# Altium schematic sheet secondary_LTC.SchDoc: foxBMS BMS-Slave 12-Cell
size A3; DocumentNumber: 21; SheetNumber: 21; SheetTotal: 21; AUTHOR: Fraunhofer IISB foxBMS Team; SheetDescription: Secondary LTC6811
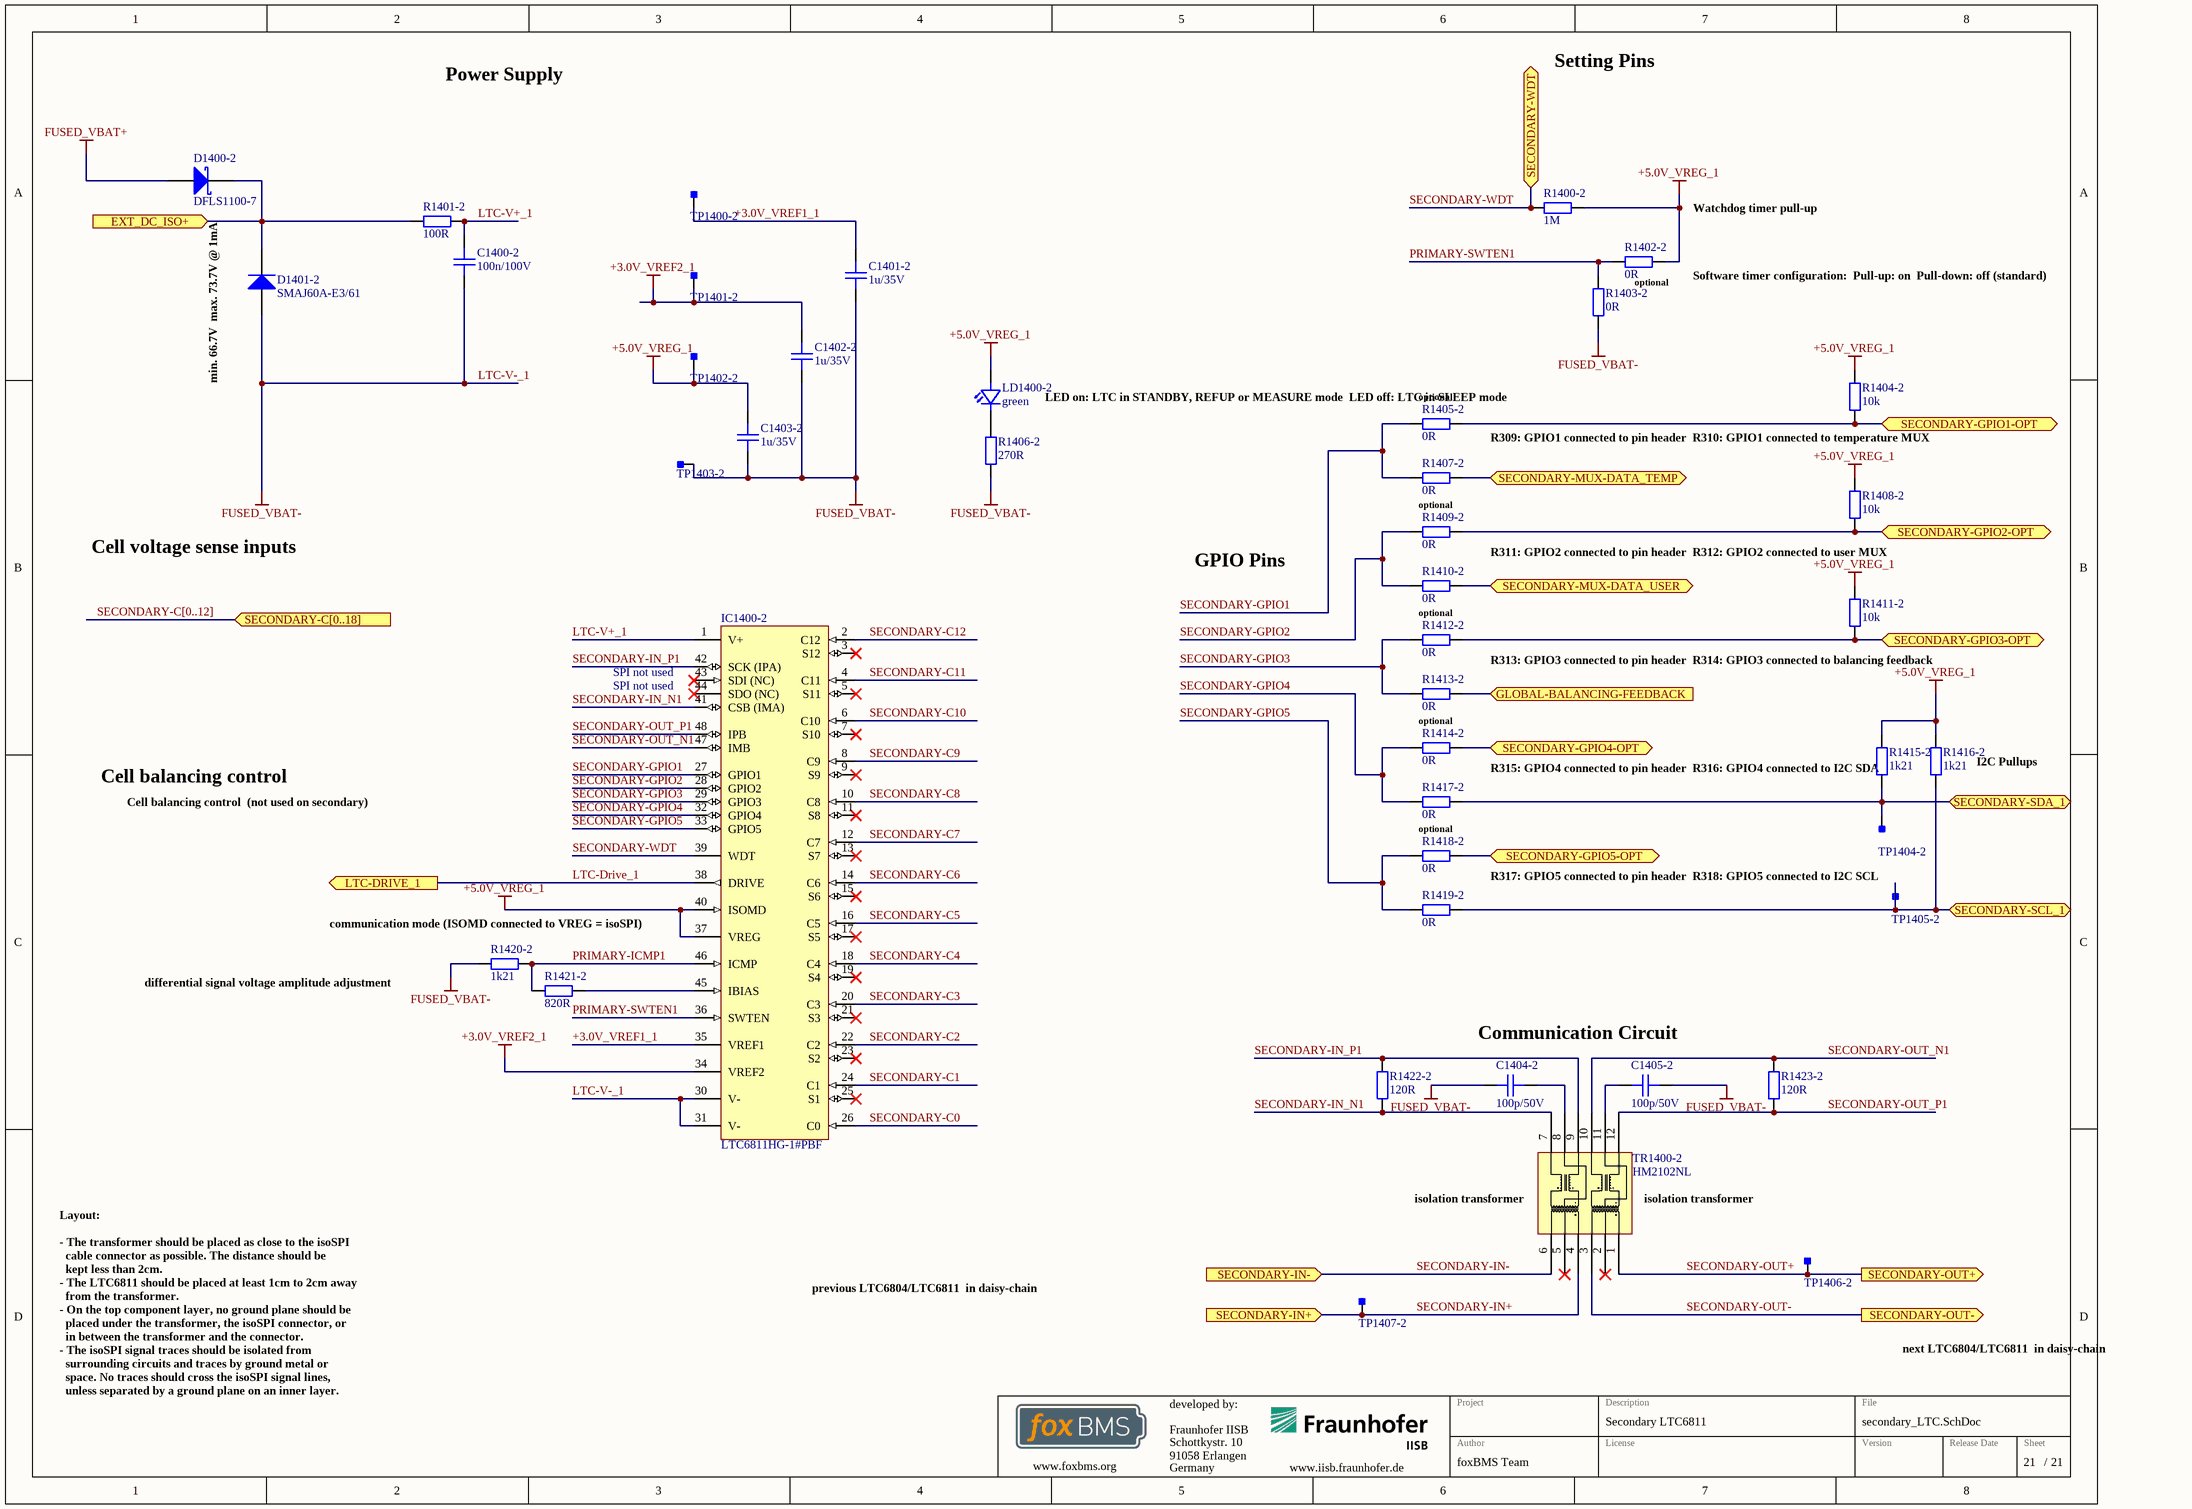
[diagram p0: secondary_LTC.SchDoc]

## Parts
C1400-2  100n/100V  [CAPC2012X14N]
C1401-2  1u/35V  [CAPC1608X08N]
C1402-2  1u/35V  [CAPC1608X08N]
C1403-2  1u/35V  [CAPC1608X08N]
C1404-2  100p/50V  [CAPC1608X08N]
C1405-2  100p/50V  [CAPC1608X08N]
D1400-2  DFLS1100-7  [DIOD-POWERDI123-2_V]
D1401-2  SMAJ60A-E3/61  [VISH-DO-214AC-2_N]
IC1400-2  LTC6811HG-1#PBF  [LT-G-48_L]
LD1400-2  green  [LEDC1608X07N]
R1400-2  1M  [RESC1608X05N]
R1401-2  100R  [RESC2012X05N]
R1402-2  0R  [RESC1608X05N]
R1403-2  0R  [RESC1608X05N]
R1404-2  10k  [RESC1608X05N]
R1405-2  0R  [RESC1608X05N]
R1406-2  270R  [RESC1608X05N]
R1407-2  0R  [RESC1608X05N]
R1408-2  10k  [RESC1608X05N]
R1409-2  0R  [RESC1608X05N]
R1410-2  0R  [RESC1608X05N]
R1411-2  10k  [RESC1608X05N]
R1412-2  0R  [RESC1608X05N]
R1413-2  0R  [RESC1608X05N]
R1414-2  0R  [RESC1608X05N]
R1415-2  1k21  [RESC1608X05N]
R1416-2  1k21  [RESC1608X05N]
R1417-2  0R  [RESC1608X05N]
R1418-2  0R  [RESC1608X05N]
R1419-2  0R  [RESC1608X05N]
R1420-2  1k21  [RESC1608X05N]
R1421-2  820R  [RESC1608X05N]
R1422-2  120R  [RESC1608X05N]
R1423-2  120R  [RESC1608X05N]
TP1400-2  Testpoint_Square  [Testpoint_S1]  (value not drawn)  (no BOM)
TP1401-2  Testpoint_Square  [Testpoint_S1]  (value not drawn)  (no BOM)
TP1402-2  Testpoint_Square  [Testpoint_S1]  (value not drawn)  (no BOM)
TP1403-2  Testpoint_Square  [Testpoint_S1]  (value not drawn)  (no BOM)
TP1404-2  Testpoint_Square  [Testpoint_S1]  (value not drawn)  (no BOM)
TP1405-2  Testpoint_Square  [Testpoint_S1]  (value not drawn)  (no BOM)
TP1406-2  Testpoint_Square  [Testpoint_S1]  (value not drawn)  (no BOM)
TP1407-2  Testpoint_Square  [Testpoint_S1]  (value not drawn)  (no BOM)
TR1400-2  HM2102NL  [HM2102NL]

## Ports
EXT_DC_ISO+ (in), GLOBAL-BALANCING-FEEDBACK (in), LTC-DRIVE_1 (out), SECONDARY-C[0..18] (in), SECONDARY-GPIO1-OPT (bidir), SECONDARY-GPIO2-OPT (bidir), SECONDARY-GPIO3-OPT (bidir), SECONDARY-GPIO4-OPT (bidir), SECONDARY-GPIO5-OPT (bidir), SECONDARY-IN+ (in), SECONDARY-IN- (in), SECONDARY-MUX-DATA_TEMP (bidir), SECONDARY-MUX-DATA_USER (bidir), SECONDARY-OUT+ (out), SECONDARY-OUT- (out), SECONDARY-SCL_1 (bidir), SECONDARY-SDA_1 (bidir), SECONDARY-WDT (bidir)

## Nets
+3.0V_VREF2_1: C1402-2.2 IC1400-2.34(VREF2) TP1401-2.1
+5.0V_VREG_1: C1403-2.2 IC1400-2.37(VREG) IC1400-2.40(ISOMD) LD1400-2.2(A) R1400-2.2 R1402-2.2 R1404-2.2 R1408-2.2 R1411-2.2 R1415-2.2 R1416-2.2 TP1402-2.1
FUSED_VBAT+: D1400-2.1(A)
LTC-V-_1: C1400-2.2 C1401-2.1 C1402-2.1 C1403-2.1 C1404-2.1 C1405-2.1 D1401-2.2(A) IC1400-2.30(V-) IC1400-2.31(V-) R1403-2.1 R1406-2.1 R1420-2.1 TP1403-2.1  [also labelled FUSED_VBAT-]
+3.0V_VREF1_1: C1401-2.2 IC1400-2.35(VREF1) TP1400-2.1
EXT_DC_ISO+: D1400-2.2(K) D1401-2.1(K) R1401-2.1 ; port EXT_DC_ISO+
GLOBAL-BALANCING-FEEDBACK: R1413-2.1 ; port GLOBAL-BALANCING-FEEDBACK
LTC-Drive_1: IC1400-2.38(DRIVE) ; port LTC-DRIVE_1
LTC-V+_1: C1400-2.1 IC1400-2.1(V+) R1401-2.2
PRIMARY-ICMP1: IC1400-2.46(ICMP) R1420-2.2 R1421-2.1
PRIMARY-SWTEN1: IC1400-2.36(SWTEN) R1402-2.1 R1403-2.2
SECONDARY-C0: IC1400-2.26(C0)
SECONDARY-C1: IC1400-2.24(C1)
SECONDARY-C2: IC1400-2.22(C2)
SECONDARY-C3: IC1400-2.20(C3)
SECONDARY-C4: IC1400-2.18(C4)
SECONDARY-C5: IC1400-2.16(C5)
SECONDARY-C6: IC1400-2.14(C6)
SECONDARY-C7: IC1400-2.12(C7)
SECONDARY-C8: IC1400-2.10(C8)
SECONDARY-C9: IC1400-2.8(C9)
SECONDARY-C10: IC1400-2.6(C10)
SECONDARY-C11: IC1400-2.4(C11)
SECONDARY-C12: IC1400-2.2(C12)
SECONDARY-GPIO1: IC1400-2.27(GPIO1) R1405-2.2 R1407-2.2
SECONDARY-GPIO1-OPT: R1404-2.1 R1405-2.1 ; port SECONDARY-GPIO1-OPT
SECONDARY-GPIO2: IC1400-2.28(GPIO2) R1409-2.2 R1410-2.2
SECONDARY-GPIO2-OPT: R1408-2.1 R1409-2.1 ; port SECONDARY-GPIO2-OPT
SECONDARY-GPIO3: IC1400-2.29(GPIO3) R1412-2.2 R1413-2.2
SECONDARY-GPIO3-OPT: R1411-2.1 R1412-2.1 ; port SECONDARY-GPIO3-OPT
SECONDARY-GPIO4: IC1400-2.32(GPIO4) R1414-2.2 R1417-2.2
SECONDARY-GPIO4-OPT: R1414-2.1 ; port SECONDARY-GPIO4-OPT
SECONDARY-GPIO5: IC1400-2.33(GPIO5) R1418-2.2 R1419-2.2
SECONDARY-GPIO5-OPT: R1418-2.1 ; port SECONDARY-GPIO5-OPT
SECONDARY-IN+: TP1407-2.1 TR1400-2.4 ; port SECONDARY-IN+
SECONDARY-IN-: TR1400-2.6 ; port SECONDARY-IN-
SECONDARY-IN_N1: IC1400-2.41(CSB_(IMA)) R1422-2.2 TR1400-2.7
SECONDARY-IN_P1: IC1400-2.42(SCK_(IPA)) R1422-2.1 TR1400-2.9
SECONDARY-MUX-DATA_TEMP: R1407-2.1 ; port SECONDARY-MUX-DATA_TEMP
SECONDARY-MUX-DATA_USER: R1410-2.1 ; port SECONDARY-MUX-DATA_USER
SECONDARY-OUT+: TP1406-2.1 TR1400-2.1 ; port SECONDARY-OUT+
SECONDARY-OUT-: TR1400-2.3 ; port SECONDARY-OUT-
SECONDARY-OUT_N1: IC1400-2.47(IMB) R1423-2.2 TR1400-2.10
SECONDARY-OUT_P1: IC1400-2.48(IPB) R1423-2.1 TR1400-2.12
SECONDARY-SCL_1: R1416-2.1 R1419-2.1 TP1405-2.1 ; port SECONDARY-SCL_1
SECONDARY-SDA_1: R1415-2.1 R1417-2.1 TP1404-2.1 ; port SECONDARY-SDA_1
SECONDARY-WDT: IC1400-2.39(WDT) R1400-2.1 ; port SECONDARY-WDT
NetC1404-2_2: C1404-2.2 TR1400-2.8
NetC1405-2_2: C1405-2.2 TR1400-2.11
NetIC1400-2_45: IC1400-2.45(IBIAS) R1421-2.2
NetLD1400-2_1: LD1400-2.1(C) R1406-2.2

Not connected (* = marked no-connect by the designer): IC1400-2 3(S12)* 5(S11)* 7(S10)* 9(S9)* 11(S8)* 13(S7)* 15(S6)* 17(S5)* 19(S4)* 21(S3)* 23(S2)* 25(S1)* 43(SDI_(NC))* 44(SDO_(NC))*; TR1400-2 2* 5*

## Buses and harness runs
bus SECONDARY-C[0..12] = port SECONDARY-C[0..18]

## Notes on the sheet
- Power Supply
- Setting Pins
- Watchdog timer pull-up
- min. 66.7V
  max. 73.7V @ 1mA
- (near R1402-2) optional
- (near R1402-2) Software timer configuration:
  Pull-up: on
  Pull-down: off (standard)
- (near R1405-2) LED on: LTC in STANDBY, REFUP or MEASURE mode
  LED off: LTC in SLEEP mode
- (near R1405-2) optional
- (near R1404-2) R309: GPIO1 connected to pin header
  R310: GPIO1 connected to temperature MUX
- optional
- Cell voltage sense inputs
- GPIO Pins
- R311: GPIO2 connected to pin header
  R312: GPIO2 connected to user MUX
- (near IC1400-2) SPI not used
- R313: GPIO3 connected to pin header
  R314: GPIO3 connected to balancing feedback
- Cell balancing control
- (near R1415-2) R315: GPIO4 connected to pin header
  R316: GPIO4 connected to I2C SDA
- (near R1416-2) I2C Pullups
- Cell balancing control
  (not used on secondary)
- (near R1420-2) communication mode (ISOMD connected to VREG = isoSPI)
- (near TP1405-2) R317: GPIO5 connected to pin header
  R318: GPIO5 connected to I2C SCL
- differential signal voltage amplitude adjustment
- Communication Circuit
- (near TR1400-2) isolation transformer
- previous LTC6804/LTC6811
  in daisy-chain
- next LTC6804/LTC6811
  in daisy-chain
- Layout:
  - The transformer should be placed as close to the isoSPI
  cable connector as possible. The distance should be
  kept less than 2cm.
  - The LTC6811 should be placed at least 1cm to 2cm away
  from the transformer.
  - On the top component layer, no ground plane should be
  placed under the transformer, the isoSPI connector, or
  in between the transformer and the connector.
  - The isoSPI signal traces should be isolated from
  surrounding circuits and traces by ground metal or
  space. No traces should cross the isoSPI signal lines,
  unless separated by a ground plane on an inner layer.
- Fraunhofer IISB
- Schottkystr. 10
- developed by:
- 91058 Erlangen
- Germany
- Author
- Project
- License
- Description
- File
- Version
- Release Date
- Sheet
- www.foxbms.org
- www.iisb.fraunhofer.de
- foxBMS Team
- /

## Library data of the parts
C1400-2 = gen_C_ceramic_100n_100V_X7R_0805: MLCC; Capacitance: 100n; Rated Voltage: 100V; Dielectric: X7R; Case EIA: 0805; Case Metric: 2012; Automotive Qualified: False; Part Number: gen_C_ceramic_100n_100V_X7R_0805; Supplier 1: Farnell; Supplier Part Number 1: 2320821
C1401-2 C1402-2 C1403-2 = gen_C_ceramic_1u_35V_X7R_0603: MLCC; Capacitance: 1u; Rated Voltage: 35V; Dielectric: X7R; Case EIA: 0603; Case Metric: 1608; PnP Package: C_0603_10; PnP Value: 1uF/35V/X7R; PnP equipped: x; Automotive Qualified: False; Part Number: gen_C_ceramic_1u_35V_X7R_0603; Supplier 1: Farnell; Supplier Part Number 1: 1907508
C1404-2 C1405-2 = gen_C_ceramic_100p_50V_C0G_0603: MLCC; Capacitance: 100p; Rated Voltage: 50V; Dielectric: C0G; Case EIA: 0603; Case Metric: 1608; Automotive Qualified: False; Part Number: gen_C_ceramic_100p_50V_C0G_0603; Supplier 1: Farnell; Supplier Part Number 1: 1414603
D1400-2 = CMP-2000-05099-1: 1 A High Voltage Schottky Barrier Rectifier, 0.62 V, -55 to 175 degC, 2- Pin POWERDI123, Pb-Free, Tape and Reel; Manufacturer: Diodes Inc; Average Rectified Current-Max: 1A; Peak Current-Max: 40A; Forward Voltage: 0.77V; Reverse Current-Max: 1µA; Reverse Voltage-Max [Vrrm]: 100V; Datasheet Version: Sep-14; Datasheet URL: https://datasheet.ciiva.com/15144/getdatasheetpartid-44146-15144126.pdf; Manufacturer URL: http://www.diodes.com/
D1401-2 = CMP-0548-00258-2: Transient Voltage Suppressor, 6.40 to 231 V, 60 V Stand-off Voltage, Uni-Directional, -55 to 155 degC, 2-pin DO-214AC, Pb-Free, Tape and Reel; Manufacturer: Vishay Semiconductor; VWM (V): 60; PPPM (W): 400, 300; VBR Uni-Directional (V): 6.4 to 231; IFSM: 40 A; ID (uA): 1; RoHS: TRUE; ComponentLink3Description: Package Specification; PackageReference: DO-214AC-2; PartNumber: SMAJ60A-E3/61; ComponentLink2Description: Datasheet; ComponentLink2URL: http://www.vishay.com/docs/88390/smaj50a.pdf; ComponentLink3URL: http://www.vishay.com/docs/88390/smaj50a.pdf; Packing: Tape and Reel; ComponentLink1Description: Manufacturer URL; PackageDescription: 2-Pin DO-214AC (SMA), Body 4.245 x 2.665 mm; DatasheetVersion: 12/8/2013; ComponentLink1URL: http://www.vishay.com/; Operating Junction and Storage Temperature Range: -55 to 150 degC; Mounting Technology: Surface Mount
IC1400-2 = LTC6811HG-1#PBF: Multicell Battery Monitor, 60 V Vin MAX, 48-pin SOP (G-48), -40 to 125 degC, Pb-Free; Manufacturer: Linear Technology; Type of Charger: Battery Stack Monitor; Vin Max(V): 60; Battery Chemistry: Li-Ion, Li-Polymer, NiMH; Number of Cells: > 1000 V of stacked Li-Ion cells; Automotive Qualified: False; RoHS: TRUE; ComponentLink1Description: Datasheet; ComponentLink1URL: https://cds.linear.com/docs/en/datasheet/68111fb.pdf; PartNumber: LTC6811HG-1#PBF; PackageReference: G-48; PackageVersion: Rev. Ã˜, 01/2011; ComponentLink2Description: Datasheet; Mounting Technology: Surface Mount; ComponentLink3Description: Package Specification; PackageDescription: 48-Pin Plastic SSOP, Body 12.8 x 5.3 mm, Pitch 0.5 mm; ComponentLink3URL: http://cds.linear.com/docs/en/packaging/05081887_0_G48.pdf; ComponentLink2URL: http://cds.linear.com/docs/en/datasheet/680412f.pdf; Part Number: LTC6811HG-1#PBF; Part Name: LTC6811HG-1#PBF; Operating Temperature: -40°C - +125°C; Supplier 1: Digikey; Supplier Part Number 1: LTC6811HG-1#PBF-ND
LD1400-2 = gen_LED_0603_green: LED; Breakdown Voltage: 5V; Continuous Forward Current: 20mA; Forward Voltage @ 20mA: 2.2V; Automotive Qualified: False; Part Number: gen_LED_0603_green; Color: green; Supplier 1: Farnell; Supplier Part Number 1: 2099223; PnP Package: LED_0603
R1400-2 = gen_R_1M_0603: SMD Resistor 1M 0603; Tolerance: 1%; Power: 0.1W; Case EIA: 0603; Case Metric: 1608; Maximum Working Voltage: 75V; PnP Package: R_0603; Automotive Qualified: False; Part Number: gen_R_1M_0603; Operating Temperature: -55°C - +155°C; Resistance: 1M; Series: E24, E96; PnP Value: 1M; Supplier 1: Farnell; Supplier Part Number 1: 1469746
R1401-2 = gen_R_100R_0805: SMD Resistor 100R 0805; Tolerance: 1%; Power: 0.125W; Case EIA: 0805; Case Metric: 2012; Maximum Working Voltage: 150V; PnP Package: R_0805; Automotive Qualified: False; Part Number: gen_R_100R_0805; Operating Temperature: -55°C - +155°C; Resistance: 100R; Series: E24, E96; PnP Value: 100R; Supplier 1: Farnell; Supplier Part Number 1: 1469862
R1402-2 R1403-2 R1405-2 R1407-2 R1409-2 R1410-2 R1412-2 R1413-2 R1414-2 R1417-2 R1418-2 R1419-2 = gen_R_0R_0603: SMD Resistor 0R 0603; Power: 0.1W; Case EIA: 0603; Case Metric: 1608; Maximum Working Voltage: 75V; PnP Package: R_0603; Automotive Qualified: False; Part Number: gen_R_0R_0603; Operating Temperature: -55°C - +155°C; Resistance: 0R; Series: Jumper; PnP Value: 0R; Supplier 1: Farnell; Supplier Part Number 1: 2073345
R1404-2 R1408-2 R1411-2 = gen_R_10k_0603: SMD Resistor 10k 0603; Tolerance: 1%; Power: 0.1W; Case EIA: 0603; Case Metric: 1608; Maximum Working Voltage: 75V; PnP Package: R_0603; Automotive Qualified: True; Part Number: gen_R_10k_0603; Operating Temperature: -55°C - +155°C; Resistance: 10k; Series: E24, E96; PnP Value: 10k; Supplier 1: Farnell; Supplier Part Number 1: 2073349
R1406-2 = gen_R_270R_0603: SMD Resistor 270R 0603; Tolerance: 1%; Power: 0.1W; Case EIA: 0603; Case Metric: 1608; Maximum Working Voltage: 75V; PnP Package: R_0603; Automotive Qualified: False; Part Number: gen_R_270R_0603; Operating Temperature: -55°C - +155°C; Resistance: 270R; Series: E24; PnP Value: 270R; Supplier 1: Farnell; Supplier Part Number 1: 2141320
R1415-2 R1416-2 R1420-2 = gen_R_1k21_0603: SMD Resistor 1k21 0603; Tolerance: 1%; Power: 0.1W; Case EIA: 0603; Case Metric: 1608; Maximum Working Voltage: 75V; PnP Package: R_0603; Automotive Qualified: False; Part Number: gen_R_1k21_0603; Operating Temperature: -55°C - +155°C; Resistance: 1k21; Series: E96; PnP Value: 1k21; Supplier 1: Farnell; Supplier Part Number 1: 1652852
R1421-2 = gen_R_820R_0603: SMD Resistor 820R 0603; Tolerance: 1%; Power: 0.1W; Case EIA: 0603; Case Metric: 1608; Maximum Working Voltage: 75V; PnP Package: R_0603; Automotive Qualified: False; Part Number: gen_R_820R_0603; Operating Temperature: -55°C - +155°C; Resistance: 820R; Series: E24; PnP Value: 820R; Supplier 1: Farnell; Supplier Part Number 1: 1469841
R1422-2 R1423-2 = gen_R_120R_0603: SMD Resistor 120R 0603; Tolerance: 1%; Power: 0.1W; Case EIA: 0603; Case Metric: 1608; Maximum Working Voltage: 75V; PnP Package: R_0603; Automotive Qualified: False; Part Number: gen_R_120R_0603; Operating Temperature: -55°C - +155°C; Resistance: 120R; Series: E24; PnP Value: 120R; Supplier 1: Farnell; Supplier Part Number 1: 2073369
TP1400-2 TP1401-2 TP1402-2 TP1403-2 TP1404-2 TP1405-2 TP1406-2 TP1407-2 = Testpoint_Square: Testpoint, square; Part Number: Testpoint_Square
TR1400-2 = HM2102NL: Pulse HM2102NL BMS Transformer; Automotive Qualified: True; Part Number: HM2102NL; Manufacturer: Pulse; Operating Temperature: -40°C - +125°C; ComponentLink1Description: Datasheet; ComponentLink1URL: https://www.mouser.com/ds/2/336/HM2102NL-1218600.pdf; Supplier 1: Mouser; Supplier Part Number 1: 673-HM2102NL; Supplier 2: Digikey; Supplier Part Number 2: 1840-1034-1-ND